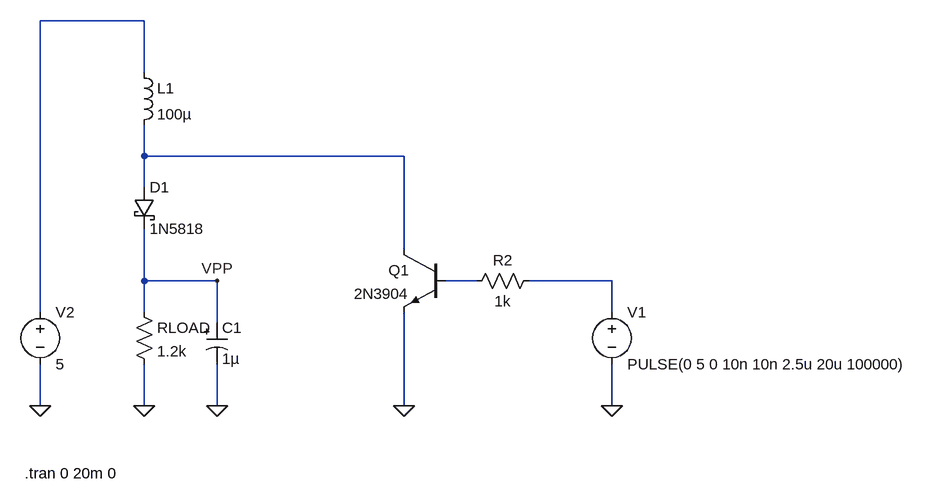
[diagram p0: schematic SimpleBoost_V4_simple.asc]
SimpleBoost_V4_simple.asc, the LTspice schematic file:
Version 4
SHEET 1 1400 712
WIRE -16 0 -176 0
WIRE -16 80 -16 0
WIRE -16 208 -16 160
WIRE 384 208 -16 208
WIRE -16 256 -16 208
WIRE 384 352 384 208
WIRE -16 400 -16 320
WIRE 96 400 -16 400
WIRE 496 400 448 400
WIRE 704 400 576 400
WIRE -176 448 -176 0
WIRE -16 448 -16 400
WIRE 704 448 704 400
WIRE 96 464 96 400
WIRE -176 592 -176 528
WIRE -16 592 -16 528
WIRE 96 592 96 528
WIRE 384 592 384 448
WIRE 704 592 704 528
FLAG 96 592 0
FLAG -16 592 0
FLAG 384 592 0
FLAG 704 592 0
FLAG -176 592 0
FLAG 96 400 VPP
SYMBOL ind -32 64 R0
SYMATTR InstName L1
SYMATTR Value 100µ
SYMATTR SpiceLine Ipk=0.75 Rser=0.48 Rpar=0 Cpar=0 mfg="Murata" pn="LQH5BPN101M38L"
SYMBOL schottky -32 256 R0
SYMATTR InstName D1
SYMATTR Value 1N5818
SYMATTR Description Diode
SYMATTR Type diode
SYMBOL res -32 432 R0
SYMATTR InstName RLOAD
SYMATTR Value 1.2k
SYMBOL polcap 80 464 R0
WINDOW 3 24 56 Left 2
SYMATTR Value 1µ
SYMATTR InstName C1
SYMATTR Description Capacitor
SYMATTR Type cap
SYMATTR SpiceLine V=25 Irms=400m Rser=0.2 Lser=0
SYMBOL npn 448 352 M0
SYMATTR InstName Q1
SYMATTR Value 2N3904
SYMBOL res 592 384 R90
WINDOW 0 0 56 VBottom 2
WINDOW 3 32 56 VTop 2
SYMATTR InstName R2
SYMATTR Value 1k
SYMBOL voltage 704 432 R0
WINDOW 123 0 0 Left 0
WINDOW 39 0 0 Left 0
SYMATTR InstName V1
SYMATTR Value PULSE(0 5 0 10n 10n 2.5u 20u 100000)
SYMBOL voltage -176 432 R0
WINDOW 123 0 0 Left 0
WINDOW 39 24 124 Left 2
SYMATTR InstName V2
SYMATTR Value 5
TEXT -200 696 Left 2 !.tran 0 20m 0

The netlist it stands for:
* SimpleBoost_V4_simple.asc
L1 N001 N002 100µ Ipk=0.75 Rser=0.48 Rpar=0 Cpar=0 mfg="Murata" pn="LQH5BPN101M38L"
D1 N002 VPP 1N5818
RLOAD VPP 0 1.2k
C1 VPP 0 1µ V=25 Irms=400m Rser=0.2 Lser=0
Q1 N002 N003 0 0 2N3904
R2 N004 N003 1k
V1 N004 0 PULSE(0 5 0 10n 10n 2.5u 20u 100000)
V2 N001 0 5
.model D D
.lib standard.dio
.model NPN NPN
.model PNP PNP
.lib standard.bjt
.tran 0 20m 0
.backanno
.end